# Altium schematic sheet Sheet2.SchDoc
size A
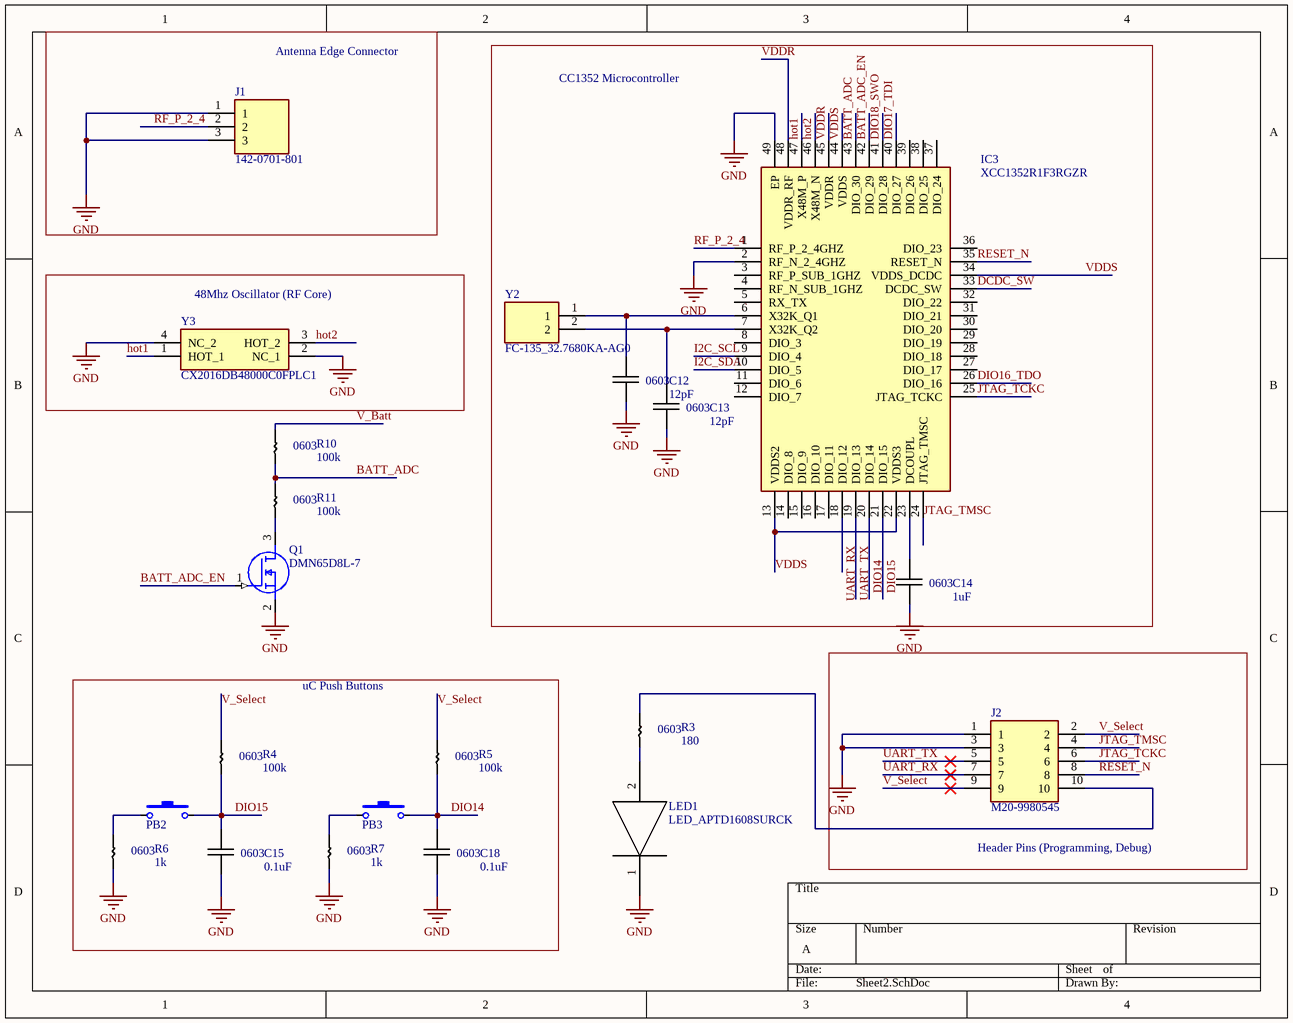
[diagram p0: Sheet2.SchDoc]

## Parts
C12  12pF  [0603_SMD]
C13  12pF  [0603_SMD]
C14  1uF  [0603_SMD]
C15  0.1uF  [0603_SMD]
C18  0.1uF  [0603_SMD]
IC3  XCC1352R1F3RGZR  [QFN50P700X700X100-49N-D]
J1  142-0701-801  [142-0701-851]
J2  M20-9980545  [HDRV10W80P254_2X5_1270X508X864P]
LED1  LED_APTD1608SURCK  [LED_APTD1608SURCK]
PB2  Interface-Push-Button  [INTERFACE-PUSH-BUTTON]  (value not drawn)
PB3  Interface-Push-Button  [INTERFACE-PUSH-BUTTON]  (value not drawn)
Q1  DMN65D8L-7  [SOT96P240X100-3N]
R3  180  [0603_SMD]
R4  100k  [0603_SMD]
R5  100k  [0603_SMD]
R6  1k  [0603_SMD]
R7  1k  [0603_SMD]
R10  100k  [0603_SMD]
R11  100k  [0603_SMD]
Y2  FC-135_32.7680KA-AG0  [FC135327680KAAG0]
Y3  CX2016DB48000C0FPLC1  [CX2016DB48000C0FPLC1]

## Blocks framed on the sheet
Antenna Edge Connector: J1
CC1352 Microcontroller: C12-C14 IC3 Y2
48Mhz Oscillator (RF Core): Y3
Header Pins (Programming, Debug): J2
uC Push Buttons: C15 C18 PB2 PB3 R4-R7

## Nets
GND: C12.1 C13.1 C14.1 C15.1 C18.1 IC3.2(RF_N_2_4GHZ) IC3.49(EP) J1.1 J1.3 J2.1 J2.3 LED1.1 Q1.2(S) R6.2 R7.2 Y3.2(NC_1) Y3.4(NC_2)
BATT_ADC: IC3.43(DIO_30) R10.2 R11.1
BATT_ADC_EN: IC3.42(DIO_29) Q1.1(G)
DCDC_SW: IC3.33(DCDC_SW)
DIO14: C18.2 IC3.20(DIO_14) PB3.2 R5.2
DIO15: C15.2 IC3.21(DIO_15) PB2.2 R4.2
DIO16_TDO: IC3.26(DIO_16)
DIO17_TDI: IC3.40(DIO_27)
DIO18_SWO: IC3.41(DIO_28)
hot1: IC3.47(X48M_P) Y3.1(HOT_1)
hot2: IC3.46(X48M_N) Y3.3(HOT_2)
I2C_SCL: IC3.9(DIO_4)
I2C_SDA: IC3.10(DIO_5)
JTAG_TCKC: IC3.25(JTAG_TCKC) J2.6
JTAG_TMSC: IC3.24(JTAG_TMSC) J2.4
RESET_N: IC3.35(RESET_N) J2.8
RF_P_2_4: IC3.1(RF_P_2_4GHZ) J1.2
UART_RX: IC3.18(DIO_12) J2.7
UART_TX: IC3.19(DIO_13) J2.5
V_Batt: R10.1
V_Select: J2.2 J2.9 R4.1 R5.1
VDDR: IC3.45(VDDR) IC3.48(VDDR_RF)
VDDS: IC3.13(VDDS2) IC3.22(VDDS3) IC3.34(VDDS_DCDC) IC3.44(VDDS)
NetC12_2: C12.2 IC3.6(X32K_Q1) Y2.1
NetC13_2: C13.2 IC3.7(X32K_Q2) Y2.2
NetC14_2: C14.2 IC3.23(DCOUPL)
NetJ2_10: J2.10 R3.1
NetLED1_2: LED1.2 R3.2
NetPB2_1: PB2.1 R6.1
NetPB3_1: PB3.1 R7.1
NetQ1_3: Q1.3(D) R11.2

Not connected (* = marked no-connect by the designer): IC3 3(RF_P_SUB_1GHZ) 4(RF_N_SUB_1GHZ) 5(RX_TX) 8(DIO_3) 11(DIO_6) 12(DIO_7) 14(DIO_8) 15(DIO_9) 16(DIO_10) 17(DIO_11) 27(DIO_17) 28(DIO_18) 29(DIO_19) 30(DIO_20) 31(DIO_21) 32(DIO_22) 36(DIO_23) 37(DIO_24) 38(DIO_25) 39(DIO_26)

## Notes on the sheet
- (in symbol C_0603) 0603
- (in symbol R_0603) 0603

## Library data of the parts
C12-C15 C18 = C_0603
IC3 = XCC1352R1F3RGZR: Integrated Circuit; Manufacturer_Name: Texas Instruments; Datasheet Link: http://www.ti.com/lit/gpn/cc1352r; Height: 1mm; Manufacturer_Part_Number: XCC1352R1F3RGZR
J1 = 142-0701-801: Connector; Manufacturer_Name: Cinch; Allied_Number: 70090267; Datasheet Link: http://www.farnell.com/datasheets/2048966.pdf; Manufacturer_Part_Number: 142-0701-801; Mouser Part Number: 530-142-0701-801; Mouser Price/Stock: https://www.mouser.com/Search/Refine.aspx?Keyword=530-142-0701-801; RS Part Number: 8861070; RS Price/Stock: http://uk.rs-online.com/web/p/products/8861070; Allied Price/Stock: https://www.alliedelec.com/johnson-cinch-connectivity-solutions-142-0701-801/70090267/
J2 = M20-9980545: Connector; Manufacturer_Name: HARWIN; Allied_Number: R1053034; Datasheet Link: https://componentsearchengine.com/Datasheets/2/M20-9980545.pdf; Height: 8.64mm; Manufacturer_Part_Number: M20-9980545; Mouser Part Number: 855-M20-9980545; Mouser Price/Stock: https://www.mouser.com/Search/Refine.aspx?Keyword=855-M20-9980545; RS Part Number: 6812950P; RS Price/Stock: http://uk.rs-online.com/web/p/products/6812950P; Allied Price/Stock: https://www.alliedelec.com/harwin-m20-9980545/R1053034/
PB2 PB3 = Interface-Push-Button: 2.5mm Tall, 2.5N Force, Straight, SMD, Push Button; Manufacturer: C&K Components; Manufacturer Part Number: PTS820 J25K SMTR LFS; Value: Single; Through Hole (y/n): N; ComponentLink1Description: Datasheet; ComponentLink1URL: https://www.mouser.com/datasheet/2/60/pts820-1382642.pdf; Category: Interface; Package: SMD-6; Supplier 1: Mouser; Supplier Part Number 1: 611-PTS820J25KSMTR; Supplier 2: Digi-Key; Supplier Part Number 2: CKN10897CT-ND
Q1 = DMN65D8L-7: MOSFET (N-Channel); Manufacturer_Name: Diodes Inc.; Allied_Number: 70550687; Datasheet Link: https://www.diodes.com/assets/Datasheets/DMN65D8L.pdf; Height: 1mm; Manufacturer_Part_Number: DMN65D8L-7; Mouser Part Number: 621-DMN65D8L-7; Mouser Price/Stock: https://www.mouser.com/Search/Refine.aspx?Keyword=621-DMN65D8L-7; RS Part Number: 8232952P; RS Price/Stock: http://uk.rs-online.com/web/p/products/8232952P; Allied Price/Stock: https://www.alliedelec.com/diodes-inc-dmn65d8l-7/70550687/
R3-R7 R10 R11 = R_0603
Y2 = FC-135_32.7680KA-AG0: Crystal or Oscillator; Manufacturer_Name: Epson Timing; Manufacturer_Part_Number: FC-135 32.7680KA-AG0; Datasheet Link: https://support.epson.biz/td/api/doc_check.php?dl=brief_FC-135&lang=en/.pdf; Height: 0mm; Mouser Part Number: 732-FC135-32.76KAAG0; Mouser Price/Stock: https://www.mouser.com/Search/Refine.aspx?Keyword=732-FC135-32.76KAAG0
Y3 = CX2016DB48000C0FPLC1: Crystal or Oscillator; Manufacturer_Name: Kyocera Electronic Components; Datasheet Link: https://componentsearchengine.com/Datasheets/1/CX2016DB48000C0FPLC1.pdf; Manufacturer_Part_Number: CX2016DB48000C0FPLC1; Mouser Part Number: 581-CX2016DB48CFPLC1; Mouser Price/Stock: https://www.mouser.com/Search/Refine.aspx?Keyword=581-CX2016DB48CFPLC1